# EAGLE design eth-generic (EAGLE 4.11)
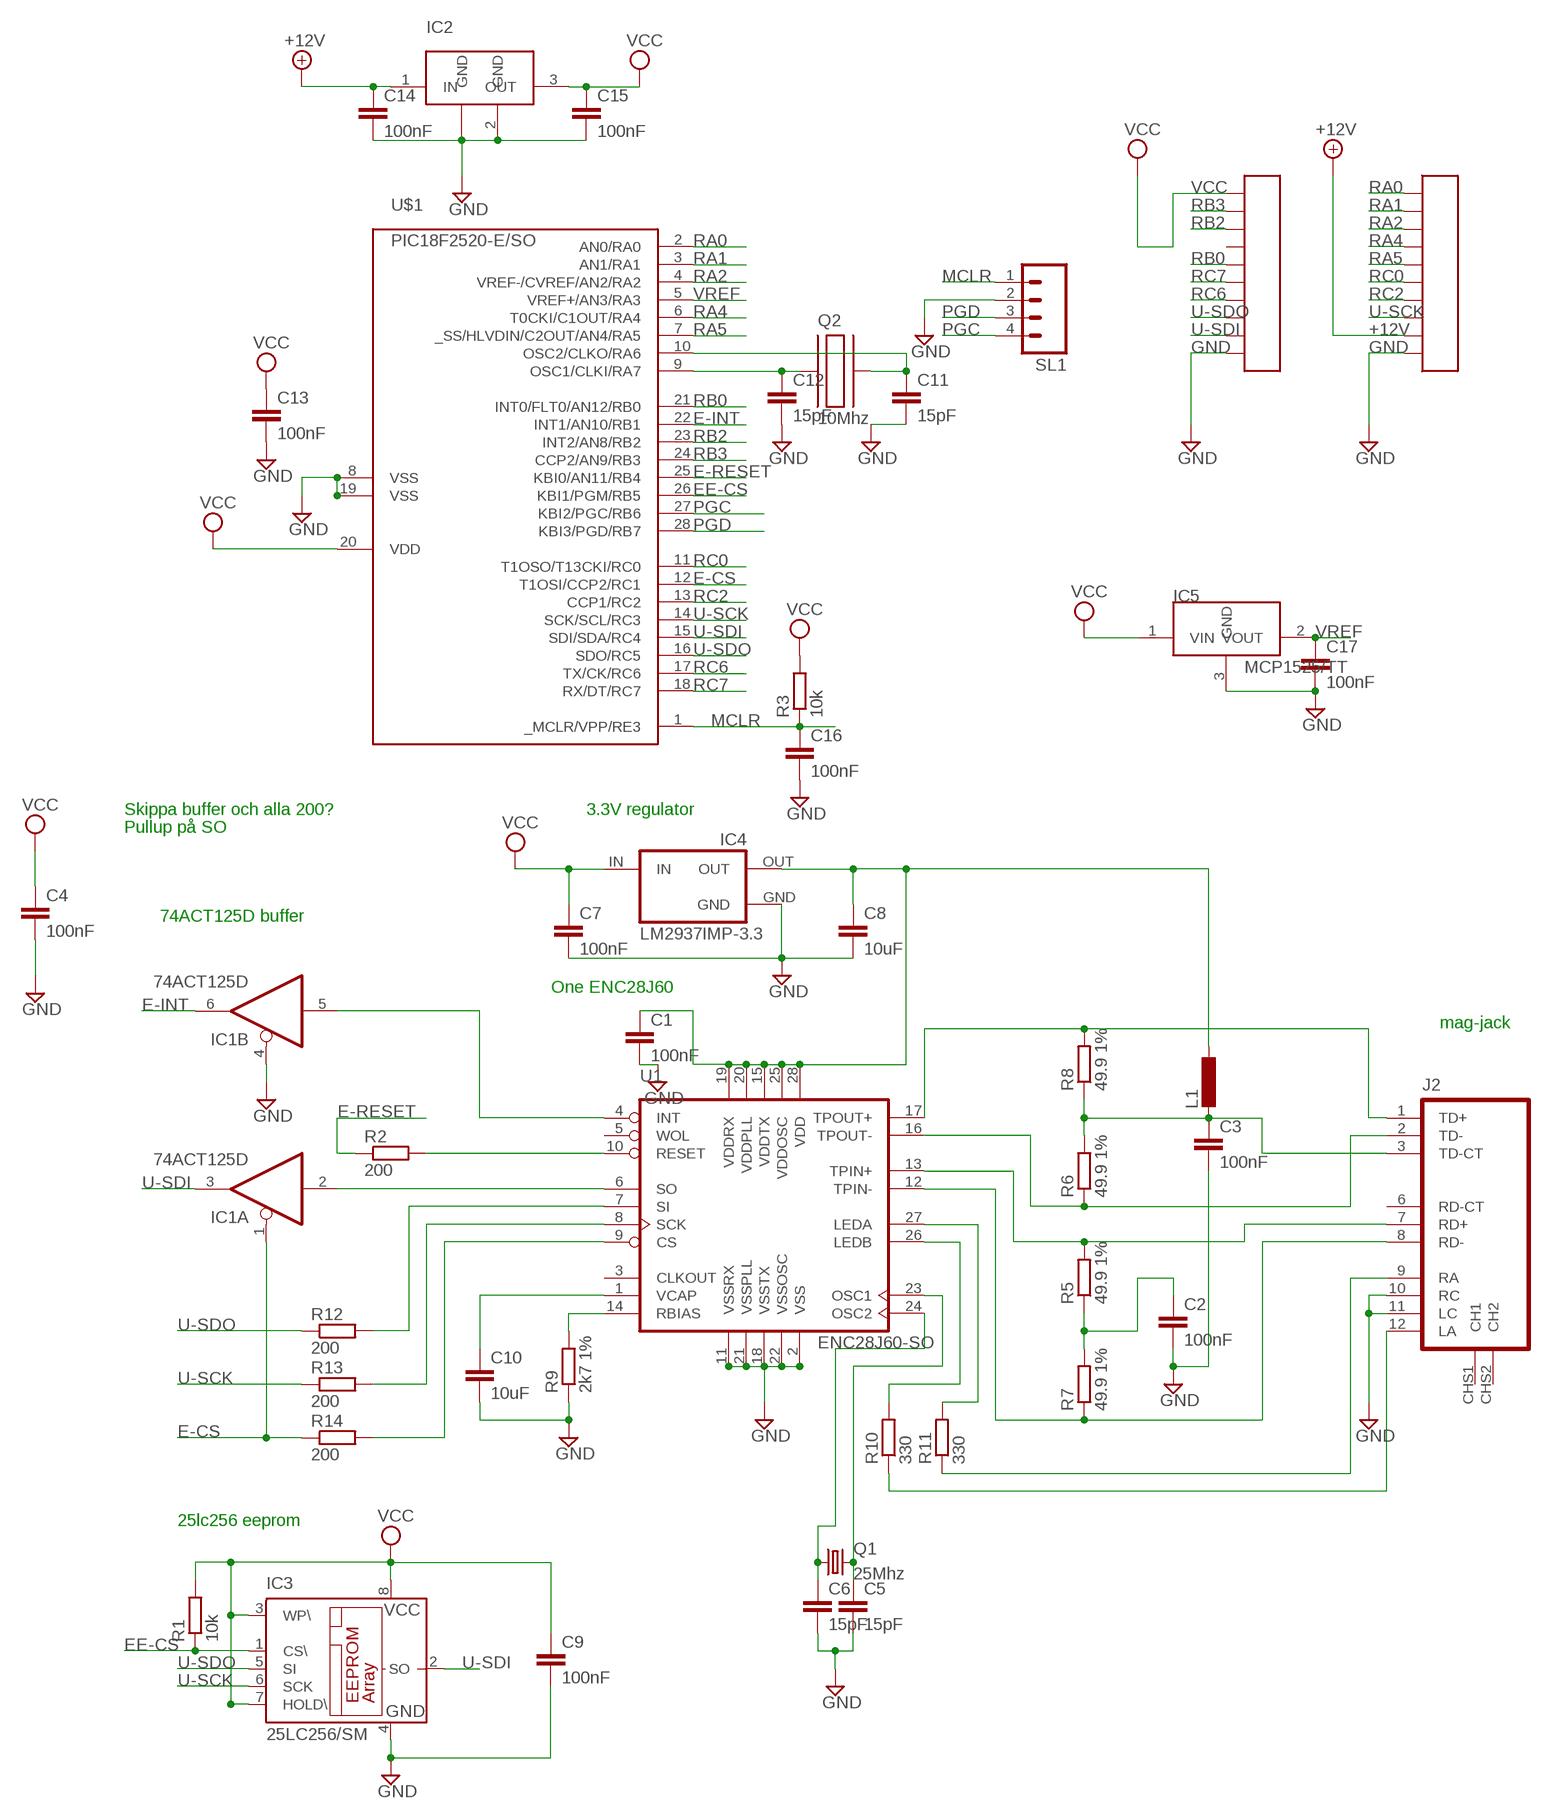
[diagram p0: schematic, sheet 1]

## Parts
C1  100nF  C-EUC0603  [C0603]
C2  100nF  C-EUC0603  [C0603]
C3  100nF  C-EUC0603  [C0603]
C4  100nF  C-EUC0603  [C0603]
C5  15pF  C-EUC0603  [C0603]
C6  15pF  C-EUC0603  [C0603]
C7  100nF  C-EUC0603  [C0603]
C8  10uF  C-EUC0603  [C0603]
C9  100nF  C-EUC0603  [C0603]
C10  10uF  C-EUC0603  [C0603]
C11  15pF  C-EUC0603  [C0603]
C12  15pF  C-EUC0603  [C0603]
C13  100nF  C-EUC0603  [C0603]
C14  100nF  C-EUC0603  [C0603]
C15  100nF  C-EUC0603  [C0603]
C16  100nF  C-EUC0603  [C0603]
C17  100nF  C-EUC0603  [C0603]
IC1  74ACT125D  [SO14]
IC2  LM340MP-5.0  [SOT223]
IC3  25LC256/SM  [SO-08M]
IC4  LM2937IMP-3.3  [SOT223]
IC5  MCP1525/TT  [SOT23]
J2  J1006F01P  [PULSEJACK-J1A]
L1  L-EUL0603  [R0603]
Q1  25Mhz  CRYTALHC49S  [HC49/S]
Q2  10Mhz  C-MAC-LFA147E  [SMD]
R1  10k  R-EU_R0603  [R0603]
R2  200  R-EU_R0603  [R0603]
R3  10k  R-EU_R0603  [R0603]
R5  49.9 1%  R-EU_R0603  [R0603]
R6  49.9 1%  R-EU_R0603  [R0603]
R7  49.9 1%  R-EU_R0603  [R0603]
R8  49.9 1%  R-EU_R0603  [R0603]
R9  2k7 1%  R-EU_R0603  [R0603]
R10  330  R-EU_R0603  [R0603]
R11  330  R-EU_R0603  [R0603]
R12  200  R-EU_R0603  [R0603]
R13  200  R-EU_R0603  [R0603]
R14  200  R-EU_R0603  [R0603]
SL1  M04  [04P]
U1  ENC28J60-SO  [SO28W]
U$1  PIC18F2520-E/SO  [SO-28W]
U$3  COLUMN10  [COLUMN10]
U$4  COLUMN10  [COLUMN10]

## Nets
3.3V: C1.1 C8.1 IC4.OUT L1.1 U1.15(VDDTX) U1.19(VDDRX) U1.20(VDDPLL) U1.25(VDDOSC) U1.28(VDD)
+12V: C14.1 IC2.1(IN) U$3.9
E-CS: IC1.1(A:OE) R14.1 U$1.12(T1OSI/CCP2/RC1)
E-INT: IC1.6(B:O) U$1.22(INT1/AN10/RB1)
E-PRE-CS: R14.2 U1.9(CS)
E-PRE-INT: IC1.5(B:I) U1.4(INT)
E-PRE-SCK: R13.2 U1.8(SCK)
E-PRE-SI: R12.2 U1.7(SI)
E-PRE-SO: IC1.2(A:I) U1.6(SO)
E-RESET: R2.1 U$1.25(KBI0/AN11/RB4)
E-TPIN+: J2.7(RD+) R5.2 U1.13(TPIN+)
E-TPIN-: J2.8(RD-) R7.1 U1.12(TPIN-)
E-TPOUT+: J2.1(TD+) R8.2 U1.17(TPOUT+)
E-TPOUT-: J2.2(TD-) R6.1 U1.16(TPOUT-)
EE-CS: IC3.1(CS\) R1.1 U$1.26(KBI1/PGM/RB5)
GND: C1.2 C2.2 C3.2 C4.2 C5.2 C6.2 C7.2 C8.2 C9.2 C10.2 C11.2 C12.2 C13.2 C14.2 C15.2 C16.2 C17.2 IC1.4(B:OE) IC2.2(GND) IC2.4(GND) IC3.4(GND) IC4.GND IC5.3(GND) J2.10(RC) J2.11(LC) R9.1 SL1.2 U1.2(VSS) U1.11(VSSRX) U1.18(VSSTX) U1.21(VSSPLL) U1.22(VSSOSC) U$1.8(VSS) U$1.19(VSS) U$3.10 U$4.10
LEDA: J2.9(RA) R11.1
LEDB: J2.12(LA) R10.1
MCLR: C16.1 R3.1 SL1.1 U$1.1(_MCLR/VPP/RE3)
N$1: R2.2 U1.10(RESET)
N$2: C11.1 Q2.P$2 U$1.10(OSC2/CLKO/RA6)
N$3: C12.1 Q2.P$1 U$1.9(OSC1/CLKI/RA7)
N$14: C2.1 R5.1 R7.2
OSC1: C6.1 Q1.1 U1.24(OSC2)
OSC2: C5.1 Q1.2 U1.23(OSC1)
PGC: SL1.4 U$1.27(KBI2/PGC/RB6)
PGD: SL1.3 U$1.28(KBI3/PGD/RB7)
PRE-LEDA: R11.2 U1.27(LEDA)
PRE-LEDB: R10.2 U1.26(LEDB)
PRE-VCAP: C10.1 U1.1(VCAP)
RA0: U$1.2(AN0/RA0) U$3.1
RA1: U$1.3(AN1/RA1) U$3.2
RA2: U$1.4(VREF-/CVREF/AN2/RA2) U$3.3
RA4: U$1.6(T0CKI/C1OUT/RA4) U$3.4
RA5: U$1.7(_SS/HLVDIN/C2OUT/AN4/RA5) U$3.5
RB0: U$1.21(INT0/FLT0/AN12/RB0) U$4.5
RB2: U$1.23(INT2/AN8/RB2) U$4.3
RB3: U$1.24(CCP2/AN9/RB3) U$4.2
RBIAS: R9.2 U1.14(RBIAS)
RC0: U$1.11(T1OSO/T13CKI/RC0) U$3.6
RC2: U$1.13(CCP1/RC2) U$3.7
RC6: U$1.17(TX/CK/RC6) U$4.7
RC7: U$1.18(RX/DT/RC7) U$4.6
TD-CT: C3.1 J2.3(TD-CT) L1.2 R6.2 R8.1
U-SCK: IC3.6(SCK) R13.1 U$1.14(SCK/SCL/RC3) U$3.8
U-SDI: IC1.3(A:O) IC3.2(SO) U$1.15(SDI/SDA/RC4) U$4.9
U-SDO: IC3.5(SI) R12.1 U$1.16(SDO/RC5) U$4.8
VCC: C4.1 C7.1 C9.1 C13.1 C15.1 IC2.3(OUT) IC3.3(WP\) IC3.7(HOLD\) IC3.8(VCC) IC4.IN IC5.1(VIN) R1.2 R3.2 U$1.20(VDD) U$4.1
VREF: C17.1 IC5.2(VOUT) U$1.5(VREF+/AN3/RA3)
Unconnected: IC1.8(C:O) IC1.9(C:I) IC1.10(C:OE) IC1.11(D:O) IC1.12(D:I) IC1.13(D:OE) J2.6(RD-CT) J2.CHS1(CH1) J2.CHS2(CH2) U1.3(CLKOUT) U1.5(WOL) U$4.4

## Notes on the sheet
- Skippa buffer och alla 200? | 3.3V regulator
- Pullup på SO
- 74ACT125D buffer
- One ENC28J60
- mag-jack
- 25lc256 eeprom

## Power pins joined to a net without a drawn wire
GND: IC1.7(P:GND) IC4.GND@(GND)
VCC: IC1.14(P:VCC)

## Library data of the parts
C1-C17 = rcl:C-EU: CAPACITOR, European symbol
IC1 = 74xx-eu:74*125: Quad bus BUFFER, 3-state
IC2 = lm340mp:LM340MP-5.0
IC3 = microchip:25LC256
IC4 = lm2937:LM2937IMP-*: 400 and 500 mA Low Dropout Voltage Regulator NATIONAL SEMICONDUCTOR created by Peter.Hofmann@ph-tronic.de <mailto:Reter.Hofmann@ph-tronic.de> 10-2004 Rev.0
IC5 = vref:MCP1525
J2 = pulsejack:J1006F01P
L1 = rcl:L-EU: INDUCTOR, European symbol
Q1 = crystal:CRYTAL: CRYSTAL
Q2 = hc49-4h-smx:C-MAC-LFA147E
R1-R3 R5-R14 = rcl:R-EU_: RESISTOR, European symbol
SL1 = con-amp-quick:M04: AMP QUICK CONNECTOR
U1 = microchip-enc28j60:ENC28J60-*: Microchip 10Mbit Eth. contoller with SPI interface
U$1 = pic18fxx20:PIC18*2520: PIC18*2520 Microchip FLASH Microcontroller with A/D DEVICE FEATURES Feature PIC18*2520 Program Memory (bytes) 32768 Program Memory (instructions) 16384 Interupt Sources 19 I/O Ports Ports A, B, C, (E) Capture/Compare/PWM Modules 2 Enhanced Capture/Compare/PWM Modules 0 Parallel Communications (PSP) No 10-bit Analog-to-Digital Module 10 input Channels Package Types 28-pin PDIP 28-pin SOIC 28-pin QFN NOTES: F only after 18, means standard voltage range from 4.2v to 5.5v LF after 18, means extended voltage range from 2.0v to 5.5v -E before / denotes extended temperature range from -40°C to +120°C -I before / denotes industrial temperature range from -40°C to +85°C /PT suffix denotes TQFP package /SO suffix denotes SOIC package /SP suffix denotes Skinny Plastic DIP package /P suffix denotes Plastic DIP package /ML suffix denotes QFN package
U$3 U$4 = expboard:COLUMN10

## Board
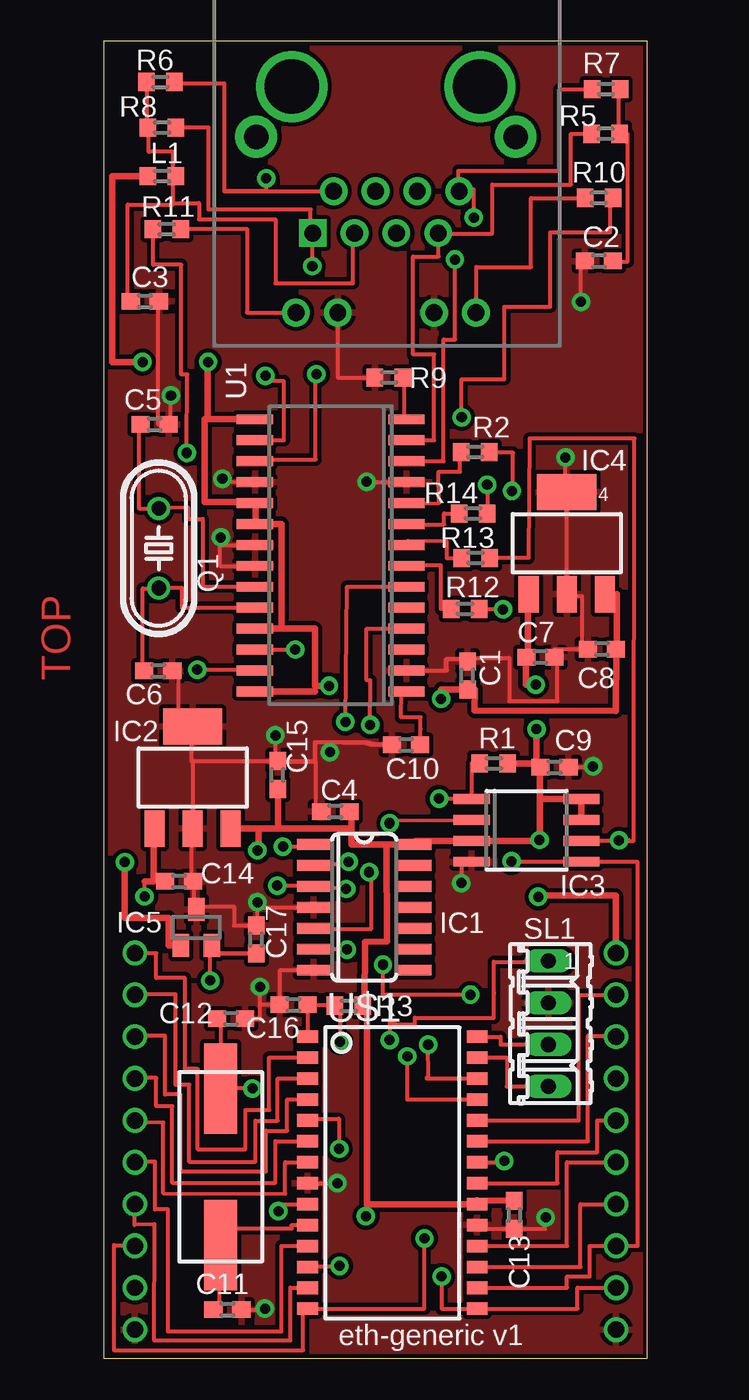
[diagram p1: board, top side]
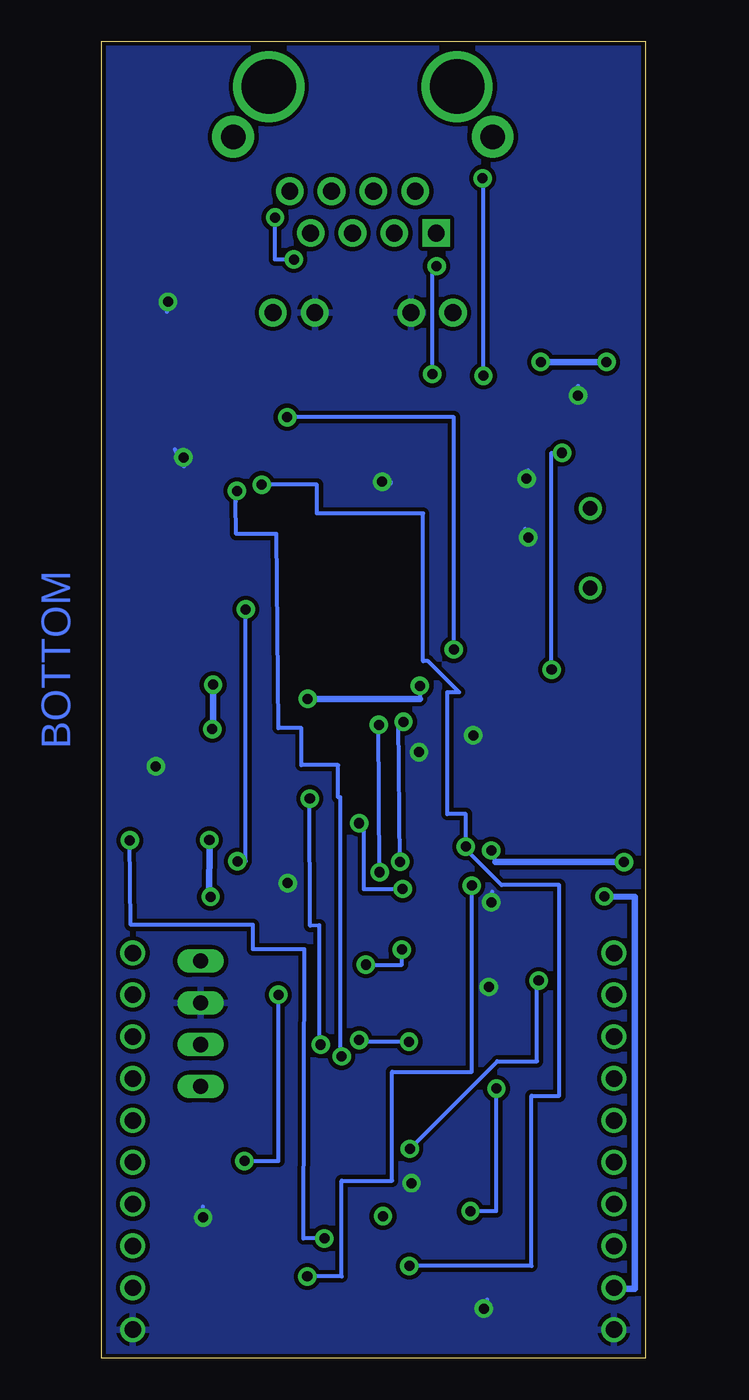
[diagram p2: board, bottom side, seen from below]

Size 33 x 79.93 mm. Coordinates in mm from the lower left corner, seen from the top.
Outline: 0,0 33,0 33,79.93 0,79.93 0,0
Copper layers (1*16): Top 0.035mm / dielectric 1.5mm / Bottom 0.035mm
Design rules "10mils": minimum track width 10mil, minimum drill 0.6mm, track to track 10mil, track to pad 10mil, pad to pad 10mil, via to via 10mil, smd to smd 10mil, copper to edge 10mil, drill to drill 10mil, minimum pad ring 10mil, minimum via ring 10mil, stop-mask expansion 0mil, vias tented up to drill 0mil, thermal gap 10mil

### Footprints (pad centres in the part's own frame; a part is rotated, then mirrored left to right if it is on the bottom)
C0603 = smd 1.1 x 1: 1 -0.85,0; 2 0.85,0
SO14 = smd 0.66 x 2.032: 1 -3.81,-3.073; 2 -2.54,-3.073; 3 -1.27,-3.073; 4 0,-3.073; 5 1.27,-3.073; 6 2.54,-3.073; 7 3.81,-3.073; 8 3.81,3.073; 9 2.54,3.073; 10 1.27,3.073; 11 0,3.073; 12 -1.27,3.073; 13 -2.54,3.073; 14 -3.81,3.073
SOT223 = smd 1.219 x 2.235: 1 -2.311,-3.099; 2 0,-3.099; 3 2.311,-3.099 | smd 3.6 x 2.2: 4 0,3.099
SO-08M = smd 0.6 x 2.2: 1 -1.905,-3.33; 2 -0.635,-3.33; 3 0.635,-3.33; 4 1.905,-3.33; 5 1.905,3.33; 6 0.635,3.33; 7 -0.635,3.33; 8 -1.905,3.33
SOT223' = smd 1.219 x 2.235: GND 0,-3.099; IN -2.311,-3.099; OUT 2.311,-3.099 | smd 3.6 x 2.2: GND@ 0,3.099
SOT23 = smd 1 x 1.4: 1 -0.95,-1.1; 2 0.95,-1.1; 3 0,1.1
PULSEJACK-J1A = drill 1.016 pad 1.676 square: 1 -4.445,-4.572 | drill 1.016 pad 1.676 round: 2 -3.175,-2.032; 3 -1.905,-4.572; 4 -0.635,-2.032; 5 0.635,-4.572; 6 1.905,-2.032; 7 3.175,-4.572; 8 4.445,-2.032; 9 -5.461,-9.398; 10 -2.921,-9.398; 11 2.921,-9.398; 12 5.461,-9.398 | drill 1.5 pad 2.54 round: CHS1 7.874,1.27; CHS2 -7.874,1.27 | drill 3.3 round: P$1 -5.715,4.318; P$2 5.715,4.318
R0603 = smd 1 x 1.1: 1 -0.85,0; 2 0.85,0
HC49/S = drill 0.889 round: 1 -2.413,0; 2 2.413,0
SMD = smd 5.5 x 2: P$1 4.75,0; P$2 -4.75,0
04P = drill 0.914 long: 1 -3.81,0; 2 -1.27,0; 3 1.27,0; 4 3.81,0
SO28W = smd 0.6 x 2.2: 1 -8.255,-4.6; 2 -6.985,-4.6; 3 -5.715,-4.6; 4 -4.445,-4.6; 5 -3.175,-4.6; 6 -1.905,-4.6; 7 -0.635,-4.6; 8 0.635,-4.6; 9 1.905,-4.6; 10 3.175,-4.6; 11 4.445,-4.6; 12 5.715,-4.6; 13 6.985,-4.6; 14 8.255,-4.6; 15 8.255,4.6; 16 6.985,4.6; 17 5.715,4.6; 18 4.445,4.6; 19 3.175,4.6; 20 1.905,4.6; 21 0.635,4.6; 22 -0.635,4.6; 23 -1.905,4.6; 24 -3.175,4.6; 25 -4.445,4.6; 26 -5.715,4.6; 27 -6.985,4.6; 28 -8.255,4.6
SO-28W = smd 0.762 x 1.27: 1 -7.62,-5.207; 2 -6.35,-5.207; 3 -5.08,-5.207; 4 -3.81,-5.207; 5 -2.54,-5.207; 6 -1.27,-5.207; 7 0,-5.207; 8 1.27,-5.207; 9 2.54,-5.207; 10 3.81,-5.207; 11 5.08,-5.207; 12 6.35,-5.207; 13 7.62,-5.207; 14 8.89,-5.207; 15 8.89,5.08; 16 7.62,5.08; 17 6.35,5.08; 18 5.08,5.08; 19 3.81,5.08; 20 2.54,5.08; 21 1.27,5.08; 22 0,5.08; 23 -1.27,5.08; 24 -2.54,5.08; 25 -3.81,5.08; 26 -5.08,5.08; 27 -6.35,5.08; 28 -7.62,5.08
COLUMN10 = drill 1 round: 1 0,11.43; 2 0,8.89; 3 0,6.35; 4 0,3.81; 5 0,1.27; 6 0,-1.27; 7 0,-3.81; 8 0,-6.35; 9 0,-8.89; 10 0,-11.43

### Placement (x,y rotation side)
C1  22.09,41.44 90 top
C2  30.07,66.59 180 top
C3  2.51,64.15 0 top
C4  14.07,33.19 180 top
C5  3.09,56.68 0 top
C6  3.32,41.72 0 top
C7  26.51,42.56 0 top
C8  30.25,43.04 180 top
C9  27.38,35.88 0 top
C10  18.36,37.22 180 top
C11  7.51,2.96 0 top
C12  7.74,20.61 0 top
C13  24.91,8.7 270 top
C14  4.59,28.94 0 top
C15  10.56,35.4 90 top
C16  11.53,21.45 180 top
C17  9.27,25.41 90 top
IC1  15.82,27.37 270 top
IC2  5.41,35.24 0 top
IC3  25.67,32.04 270 top
IC4  LM2937IMP-3.3  [SOT223']  28.11,49.47 0 top
IC5  5.63,26.15 0 top
J2  17.14,72.86 0 top
L1  3.55,71.74 0 top
Q1  3.35,49.16 90 top
Q2  7.11,11.62 90 top
R1  23.69,36.11 0 top
R2  22.55,55 180 top
R3  14.88,21.4 0 top
R5  30.47,74.31 180 top
R6  3.45,77.46 180 top
R7  30.5,77.03 0 top
R8  3.55,74.69 0 top
R9  17.32,59.53 0 top
R10  30.07,70.42 0 top
R11  3.83,68.52 180 top
R12  21.94,45.48 180 top
R13  22.58,48.58 180 top
R14  22.42,51.27 180 top
SL1  27,20.31 270 top
U1  13.79,48.73 90 top
U$1  17.6,11.9 270 top
U$3  1.9,13.17 0 top
U$4  31.11,13.17 0 top

### Tracks (layer width: path | path; a pad name or v marks a point on that pad's centre or on a via)
3.3V  (via drill 0.61)
  Top 0.254: 31.16,43.04 31.13,43.04 C8.1 | 31.16,46.37 IC4.OUT | C1.1 22.55,40.59 | 6.14,56.99 6.32,56.99 6.32,56.91 | 9.14,51.96 9.14,51.91 U1.19 9.24,51.91 | 9.24,50.56 9.24,50.64 U1.20 | U1.25 9.16,44.29 9.16,44.26 | 6.32,60.47 v6.35,60.47 | 12.82,40.48 12.82,40.83 12.82,40.81 | U1.28 9.27,40.48 9.27,40.5
  Top 0.406: 31.16,43.04 31.16,46.37 | 22.55,40.59 22.52,39.31 31.11,39.3 31.13,43.04 | U1.15 6.32,56.99 6.32,60.47 | 6.14,56.99 6.14,51.96 9.14,51.96 | 9.24,50.64 9.24,51.91 | U1.20 10.79,50.64 10.79,44.29 | 10.79,44.29 9.16,44.29 | L1.1 0.53,71.74 0.53,60.47 v2.36,60.47 | 10.79,44.29 12.82,44.29 12.82,40.83 | 9.27,40.48 12.82,40.48 | C1.1 20.49,40.59 v20.49,40.02 | 12.82,40.81 v13.69,40.81
  Bottom 0.254: v13.69,40.81 13.69,40.02
  Bottom 0.406: v6.35,60.47 v2.36,60.47 | 13.69,40.02 v20.49,40.02
+12V  (via drill 0.61)
  Top 0.254: 3.04,32.14 IC2.1 | 3.04,28.94 C14.1 | v2.48,28.03 2.48,28.94
  Top 0.406: 3.04,32.14 3.04,28.94 2.48,28.94
  Bottom 0.254: U$3.9 1.95,4.28 1.95,4.23
  Bottom 0.406: v2.48,28.03 0.63,28 0.63,4.23 1.95,4.23
E-CS  (via drill 0.61)
  Top 0.254: R14.1 v23.29,53.02 | IC1.1 12.7,31.18 12.7,31.05 v10.89,31.05 | U$1.12 14.32,5.55 v14.32,5.6
  Bottom 0.254: v23.29,53.02 19.93,53.02 19.93,51.27 13.48,51.27 13.48,42.3 13.18,42.3 11.3,40.42 12.01,40.42 12.01,33.03 10.89,33.03 v10.89,31.05 10.87,31.05 | v14.32,5.6 6.9,5.6 6.9,15.94 5.23,15.94 5.23,28.71 8.73,28.71 11.04,31.03 10.89,31.03 10.87,31.05 | 10.87,31.05 10.84,31.08
E-INT  (via drill 0.61)
  Top 0.254: U$1.22 24.02,11.9 v24.33,11.98 | v22.27,22.06 16.96,22.06 v16.96,23.89 | 12.87,24.83 12.87,24.85 | 12.87,24.83 IC1.6 | v14.78,24.8 12.87,24.8 12.87,24.83
  Bottom 0.254: v24.33,11.98 22.27,11.98 v22.27,22.06 | v16.96,23.89 14.78,23.89 v14.78,24.8
E-PRE-CS
  Top 0.254: R14.2 20.67,51.27 20.67,50.61 18.38,50.61 | 18.38,50.61 U1.9 | 18.38,50.61 18.38,50.58
E-PRE-INT  (via drill 0.61)
  Top 0.254: U1.4 15.97,44.29 15.97,41.16 16.2,41.14 v16.17,38.44 | v16.12,29.5 16.25,29.91 16.25,26.07 12.8,26.07 12.8,26.1 IC1.5
  Bottom 0.254: v16.17,38.44 16.2,38.44 v16.12,29.5
E-PRE-SCK
  Top 0.254: R13.2 20.82,48.58 20.82,49.59 18.49,49.62 18.49,49.37 U1.8
E-PRE-SI
  Top 0.254: R12.2 20.47,45.48 20.47,48.12 18.46,48.12 18.46,48.1 U1.7
E-PRE-SO  (via drill 0.61)
  Top 0.254: U1.6 14.78,46.83 v14.68,38.62 | 14.88,30.37 v14.88,30.14 14.88,30.01 12.82,30.01 | 12.82,30.01 12.82,29.91 IC1.2 | 12.82,30.01 12.82,30.04
  Bottom 0.254: v14.68,38.62 14.98,38.62 v14.88,30.14
E-RESET  (via drill 0.61)
  Top 0.254: U$1.25 18.43,15.71 v18.43,18.33 | v24.79,52.64 24.86,52.64 24.86,54.95 23.24,54.95 23.34,54.93 R2.1
  Bottom 0.254: v18.43,18.33 18.51,18.33 18.51,34.05 18.64,34.05 18.64,36.01 20.87,36.01 20.87,38.24 22.27,38.24 22.4,50.03 24.84,50.03 24.86,52.01 24.76,52.67 v24.79,52.64
E-TPIN+
  Top 0.254: R5.2 28.37,74.31 28.37,71.23 23.59,71.23 23.59,68.26 20.37,68.26 20.37,68.29 | 20.37,68.29 20.37,68.31 | 20.37,68.29 J2.7 20.34,68.29 20.34,66.87 18.79,66.87 18.79,60.92 20.06,60.92 20.06,55.72 U1.13
E-TPIN-  (via drill 0.61)
  Top 0.254: R7.1 27.68,77.03 27.68,72.07 21.53,72.07 21.53,70.85 | 21.53,70.83 21.53,70.8 | U1.12 20.64,54.45 20.64,61.84 21.33,61.84 v21.33,66.69 | v22.47,69.23 22.47,70.93 21.53,70.93 21.53,70.85 | 21.53,70.85 21.53,70.83 | 21.53,70.83 J2.8
  Bottom 0.254: v21.33,66.69 22.47,66.69 v22.47,69.23
E-TPOUT+  (via drill 0.61)
  Top 0.254: R8.2 6.37,74.69 6.37,69.71 12.57,69.71 12.57,68.29 | 12.57,68.29 12.57,68.24 12.67,68.24 v12.67,66.28 | 12.57,68.29 J2.1 | v12.92,59.73 12.87,59.73 12.87,54.55 9.19,54.55 U1.17
  Bottom 0.254: v12.67,66.28 12.92,66.28 v12.92,59.73
E-TPOUT-  (via drill 0.61)
  Top 0.254: 7.34,70.83 J2.2 | 7.34,70.83 7.34,77.36 4.31,77.36 4.31,77.46 | 4.31,77.46 4.31,77.53 | 4.31,77.46 R6.1 | 7.34,70.83 9.88,70.83 v9.88,71.62 | v9.83,59.63 9.9,59.63 9.9,59.3 10.94,59.3 10.94,55.72 U1.16
  Bottom 0.254: v9.88,71.62 10.05,71.62 10.05,71.64 9.83,71.64 v9.83,59.63
EE-CS  (via drill 0.61)
  Top 0.254: R1.1 22.35,36.11 IC3.1 | U$1.26 19.63,16.98 19.63,17.03 19.73,17.03 v19.7,19.04 | IC3.1 22.35,33.85 | IC3.1 | v20.37,33.97 22.35,33.97 IC3.1
  Bottom 0.254: v19.7,19.04 19.78,19.16 19.78,26.28 20.34,26.25 v20.37,33.97
GND  (via drill 0.61)
  Top 0.254: U$1.19 22.75,8.09 23.08,7.85 C13.2 26.79,7.85 v26.84,8.55 | C6.2 4.57,41.72 4.57,38.34 IC2.4 5.33,38.34 | 5.33,38.34 5.33,38.47 | 5.43,36.25 5.33,36.25 5.33,38.34 | 5.43,36.25 C15.2 10.56,36.21 12.87,36.21 | 5.43,36.25 5.43,36.31 | 5.43,36.25 5.43,32.14 IC2.2 5.35,32.14 5.35,28.97 | C14.2 5.35,28.94 5.35,28.97 | 5.66,27.42 5.66,27.25 IC5.3 | 5.66,27.42 7.92,27.42 7.92,26.26 C17.2 9.34,26.26 9.34,27.45 | 5.35,28.97 5.48,28.97 5.48,27.42 5.66,27.42 | 9.34,27.45 v9.34,27.67 | 9.34,27.45 9.29,27.45 9.29,27.37 IC1.4 | U1.18 7.23,53.2 v7.21,53.38 | 3.32,64.15 3.32,64.17 | 3.32,64.15 C3.2 | 3.32,64.15 3.32,56.68 C5.2 4.08,56.68 v4.08,58.43 | 29.05,43.04 C8.2 | 29.05,43.04 29.05,46.24 28.11,46.24 IC4.GND | IC4.GND | IC4.GND IC4.GND@ 28.04,52.57 v28.04,54.67 | C1.2 22.07,42.29 22.07,42.43 20.8,42.43 20.8,41.75 U1.2 20.85,41.75 20.85,42.46 22.12,42.46 22.12,42.51 24.63,42.51 24.63,39.89 27.55,39.89 27.55,42.63 27.38,42.63 | 27.38,42.56 27.38,42.53 | 27.38,42.56 C7.2 | 29.05,43.04 27.38,43.04 27.38,42.63 | 27.38,42.63 27.38,42.56 | U1.11 15.97,53.18 v15.97,53.2 | C2.2 28.98,66.59 v28.98,64.12 | R9.1 14.22,59.53 J2.10 | 7.08,49.37 7.08,48.1 U1.22 | U1.22 | U1.22 9.19,48.07 | 7.08,49.37 U1.21 | 7.08,49.37 v7.11,49.82 | C11.2 9.57,2.96 v9.8,3.01 | C4.2 12.87,33.19 12.87,36.21 | C12.2 9.5,20.61 9.5,21.48 | 9.5,21.48 10.54,21.48 10.54,21.45 C16.2 10.71,21.45 | 10.71,21.45 10.71,21.43 | 10.71,21.48 10.71,21.45 | IC1.7 10.71,23.56 10.71,21.48 | 9.5,21.48 10.71,21.48 | 9.5,21.48 v9.5,22.54 | 12.87,36.21 12.85,36.21 12.82,37.4 16.17,37.35 16.23,37.3 C10.2 | C9.2 29.46,35.88 v29.71,35.93 | U$1.8 v14.19,10.63 | IC3.4 21.71,30.14 v21.71,28.84
  Top 0.254: C10.2 15.97,37.3 15.97,37.38 13.71,37.35 v13.74,36.79 | C10.2 16.17,37.22 16.02,37.38 12.85,37.38 12.85,36.26 12.82,36.23 C15.2 10.43,36.36 v10.43,37.81
  Bottom 0.254: v26.84,8.55 26.84,9.21 | v9.34,27.67 9.29,27.67 9.29,28.31 | v7.21,53.38 7.11,53.38 7.11,53.89 | v28.04,54.67 28.01,54.14 28.54,55.16 | v15.97,53.2 15.46,53.2 15.46,53.1 | v28.98,64.12 29.05,64.12 29.05,63.51 | v7.11,49.82 7.29,50.33 | v4.08,58.43 4.08,59.02 | v9.8,3.01 9.6,3.04 9.6,3.57 | v9.5,22.54 9.47,22.36 9.47,22.59 | v29.71,35.93 29.56,35.93 29.56,35.95 | v14.19,10.63 14.35,10.63 14.35,10.65 | v21.71,28.84 21.74,29.1 21.74,28.99 | v13.74,36.79 13.81,36.79 13.81,36.44 | v10.43,37.81 10.16,38.09
  pour Bottom (isolate 0.254): 0.22,79.69 0.22,0.27 32.68,0.27 32.66,79.69
  pour Top: 0.12,79.59 0.25,79.59 0.25,0.24 32.76,0.24 32.76,0.6 32.76,79.72 0.12,79.72
LEDA
  Top 0.254: J2.9 8.71,63.46 8.71,68.54 4.87,68.54 4.87,68.52 R11.1
LEDB
  Top 0.254: R10.1 25.95,70.42 25.95,66.23 22.63,66.23 22.63,63.46 J2.12
MCLR  (via drill 0.61)
  Top 0.254: R3.1 14.09,21.4 14.09,21.45 | 14.09,21.45 C16.1 12.42,21.45 12.42,19.52 U$1.1 | 14.09,21.45 14.35,21.45 v14.35,19.21 | 23.69,22.24 23.69,22.11 | 23.69,22.24 23.69,24.07 26.94,24.07 26.94,24.12 | 26.94,24.12 26.94,24.14 | 26.94,24.12 SL1.1 | v17.37,19.32 17.39,20.38 17.75,20.28 18.56,20.26 18.89,20.26 18.89,20.66 23.69,20.66 23.69,22.24
  Bottom 0.254: v14.35,19.21 17.32,19.21 v17.37,19.32
N$1
  Top 0.254: R2.2 21.64,55.03 21.64,53.81 20.34,53.81 20.37,51.91 18.41,51.88 18.41,51.91 | 18.41,51.91 18.41,51.93 | U1.10 18.41,51.91
N$2
  Top 0.254: Q2.P$2 7.08,6.87 7.08,6.79 | C11.1 7.03,3.14 7.08,6.79 | 7.08,6.79 7.03,6.79 7.06,7.89 11.43,7.89 11.43,8.09 U$1.10
N$3  (via drill 0.61)
  Top 0.254: 7.13,16.37 7.13,16.32 | C12.1 7.13,20.61 7.13,16.37 | U$1.9 10.61,9.36 v10.61,8.93 | 7.13,16.37 | 7.13,16.37 Q2.P$1 | v9.04,16.37 7.13,16.37 | 7.13,16.37 7.13,16.22
  Bottom 0.254: v10.61,8.93 9.04,8.93 v9.04,16.37
N$14
  Top 0.254: R7.2 31.29,77.03 31.29,74.31 | 31.29,74.31 R5.1 | 31.29,74.31 31.82,74.31 31.82,66.56 30.93,66.56 30.93,66.59 C2.1
OSC1
  Top 0.254: C6.1 2.38,41.72 2.38,46.72 3.27,46.72 3.27,46.75 Q1.1 3.4,46.75 3.4,46.77 4.75,46.77 4.75,45.56 U1.24
OSC2
  Top 0.254: U1.23 6.02,46.83 6.02,50.94 5.13,50.94 5.13,51.65 3.35,51.63 Q1.2 2.15,51.58 2.15,56.68 | 2.15,56.68 2.15,56.71 | 2.15,56.68 C5.1
PGC
  Top 0.254: SL1.4 24.48,16.5 24.48,18.25 U$1.27 22.68,18.27
PGD
  Top 0.254: SL1.3 24.1,19.04 24.1,19.52 U$1.28
PRE-LEDA  (via drill 0.61)
  Top 0.254: R11.2 3.02,68.52 3.02,66.36 4.72,66.36 4.72,59.7 5.08,59.7 v5.05,54.95 | U1.27 9.19,41.69 | U1.27 | v5.69,41.8 9.19,41.8 U1.27
  Bottom 0.254: v5.05,54.95 5.69,54.95 v5.69,41.8
PRE-LEDB  (via drill 0.61)
  Top 0.254: R10.2 30.75,70.42 30.75,68.34 27.12,68.34 27.12,63.82 24.33,63.82 24.33,59.42 21.74,59.42 v21.74,57.11 | U1.26 9.24,43.02 | 9.24,43.02 v11.63,43.02 | 9.24,43.02 9.24,42.99
  Bottom 0.254: v21.74,57.11 11.63,57.11 v11.63,43.02
PRE-VCAP
  Top 0.254: C10.1 19.25,38.21 19.25,38.9 18.05,38.9 18.08,40.48 U1.1
RA0
  Top 0.254: U$1.2 10.05,18.25 10.05,15.07 8.61,15.07 8.61,12.69 5.71,12.69 5.71,17.56 4.95,17.56 4.95,23.08 3.19,23.08 3.19,24.57 1.88,24.57 1.88,24.6 U$3.1
RA1
  Top 0.254: U$1.3 10.56,16.98 10.56,14.41 9.21,14.41 9.21,11.92 5.2,11.92 5.2,16.6 4.36,16.6 4.36,22.09 2,22.09 2,22.06 U$3.2
RA2
  Top 0.254: U$1.4 11.15,15.71 11.15,13.8 9.85,13.8 9.85,11.34 4.67,11.34 4.67,16.02 3.73,16.02 3.73,19.57 1.88,19.57 | 1.88,19.57 1.88,19.52 U$3.3 | 1.88,19.57 1.88,19.6
RA4
  Top 0.254: U$1.6 10.43,13.17 10.43,10.65 4.16,10.65 4.16,15.3 3.19,15.3 3.19,17 1.82,17 | 1.82,17 1.82,16.98 U$3.4 | 1.82,17 1.82,17.06
RA5
  Top 0.254: U$1.7 11.02,11.9 11.02,9.99 3.63,10.02 3.63,14.31 1.9,14.29 U$3.5
RB0
  Top 0.254: U$4.5 29.97,14.44 29.97,12.51 27.55,12.51 27.55,10.63 22.78,10.63 | U$1.21 22.78,10.63 | 22.78,10.63 22.78,10.65
RB2
  Top 0.254: U$1.23 29.41,13.17 29.41,19.57 31.03,19.57 31.03,19.52 U$4.3
RB3
  Top 0.254: U$4.2 28.85,22.06 28.85,14.44 22.75,14.44 | U$1.24 22.75,14.44 | 22.75,14.44 22.75,14.39
RBIAS
  Top 0.254: 18.26,59.53 18.26,59.58 | 18.26,59.53 R9.2 | U1.14 18.26,56.99 18.26,59.53
RC0
  Top 0.254: U$1.11 10.79,6.82 10.79,1.64 3.91,1.64 3.91,9.03 3.12,9.03 3.12,11.92 1.9,11.92 U$3.6
RC2
  Top 0.254: U$1.13 11.35,4.28 11.35,1.08 3.07,1.08 3.09,8.14 1.88,8.09 1.9,9.33 U$3.7
RC6
  Top 0.254: U$4.7 28.95,9.36 28.95,5.55 22.65,5.55 | U$1.17 22.65,5.55 | 22.65,5.55 22.65,5.6
RC7
  Top 0.254: U$1.18 28.14,6.82 28.14,11.9 U$4.6 31.11,11.92
TD-CT
  Top 0.254: 2.64,74.69 2.64,74.66 | 2.64,74.69 R8.1 2.74,74.69 2.74,73.22 4.21,73.22 4.21,71.74 | R6.2 2.64,77.46 2.64,74.69 | 4.21,71.74 L1.2 | C3.1 1.47,64.15 1.47,70.02 4.21,70.02 4.21,70.07 | 4.21,70.07 4.21,71.74 | J2.3 15.13,68.29 15.13,65.24 10.43,65.24 10.43,69.13 5.79,69.13 5.79,70.12 4.19,70.12 4.19,70.07 4.21,70.07
U-SCK  (via drill 0.61)
  Top 0.254: U$3.8 1.9,6.87 0.63,6.87 0.63,0.5 12.11,0.5 12.11,3.01 U$1.14 19.48,3.01 v19.48,7.28 | 31.9,31.41 IC3.6 | 31.9,31.41 32.18,31.41 32.23,55.82 25.85,55.82 25.8,48.58 23.16,48.58 | 23.16,48.58 R13.1 | 23.16,48.58 23.16,48.6 | 31.9,31.41 31.9,31.38 | v31.29,31.43 31.9,31.43 31.9,31.41
  Bottom 0.254: v19.48,7.28 20.75,7.28 20.7,24.83 23.82,24.83 23.82,26.3 31.24,26.3 v31.29,31.43
U-SDI  (via drill 0.61)
  Top 0.254: U$4.9 28.77,4.28 28.77,3.01 22.63,3.01 | 22.63,3.01 U$1.15 | 22.63,3.01 22.63,3.04 | 22.63,3.01 20.52,3.01 v20.52,4.97 | 12.9,28.64 12.9,28.54 | 12.9,28.64 IC1.3 | v10.54,28.69 12.9,28.69 12.9,28.64 | IC3.2 17.37,32.65 v17.37,32.47 | v14.73,28.49 12.9,28.66 12.9,28.64
  Bottom 0.254: v20.52,4.97 18.43,4.97 18.43,10.78 15.36,10.78 15.36,17.39 10.54,17.39 v10.54,28.69 | v17.37,32.47 17.09,32.02 17.09,28.46 14.91,28.46 v14.73,28.49
U-SDO  (via drill 0.61)
  Top 0.254: 29.51,6.82 U$4.8 | 29.51,6.82 29.51,4.97 28.14,4.97 28.14,4.28 U$1.16 | 29.51,6.82 32.43,6.82 32.43,30.11 29.03,30.11 29.03,30.14 IC3.5 24.76,30.14 v24.76,30.16 | R12.1 23.01,45.48 23.01,45.45 v24.25,45.45
  Bottom 0.254: v24.76,30.16 24.25,30.16 v24.25,45.45
VCC  (via drill 0.61)
  Top 0.254: 25.75,46.37 IC4.IN | 25.75,42.56 C7.1 25.62,42.56 | 26.51,35.88 26.51,35.83 | 26.51,35.88 C9.1 26.49,35.88 | 26.51,35.88 26.51,36.11 26.28,36.11 | IC3.7 | IC3.8 | 26.49,31.41 26.26,31.41 26.26,31.46 v26.46,31.46 | 10.59,34.55 C15.1 | 15.06,33.19 C4.1 | 15.06,32.12 15.03,32.12 15.03,32.14 | IC1.14 18.92,31.18 18.92,31.41 | 15.85,21.4 15.77,21.32 | 16,21.4 15.85,21.4 | 15.85,21.4 R3.2 | 16,9.36 16,9.49 16.02,9.49 16.02,8.62 v15.92,8.62 | v26.23,40.88 25.62,40.88 | 9.39,30.82 v9.34,30.82 | v26.39,28 26.31,28.08
  Top 0.406: C13.1 22.68,9.57 U$1.20 16,9.36 | 25.75,42.56 25.75,46.37 | 26.51,36.11 R1.2 | IC3.8 IC3.7 | 26.49,33.95 IC3.8 | 26.49,33.95 26.49,35.88 | 26.26,31.41 IC3.3 18.92,31.41 | 26.49,31.41 26.49,33.95 | 10.59,32.14 9.39,32.14 | 9.39,32.14 IC2.3 | 10.59,32.14 10.59,34.55 | 17.16,31.18 IC1.14 | 15.06,33.19 15.06,32.12 15.06,31.18 17.16,31.18 | 15.03,32.14 10.59,32.14 | 15.85,21.4 15.87,25.26 17.22,25.29 17.16,31.18 | 16,9.49 16,21.4 | 26.28,36.11 v26.28,38.19 | 25.62,40.88 25.62,42.56 | IC5.1 3.96,25.05 3.96,26.73 1.29,26.73 v1.29,30.11 | 9.39,32.14 9.39,30.82 | U$4.1 31.11,26.78 31.08,28.08 26.31,28.08
  Bottom 0.254: v15.92,8.62 15.92,8.39 | v26.28,38.19 26.23,38.52 | v9.34,30.82 9.09,30.11 | 26.49,27.95 v26.39,28
  Bottom 0.406: 26.23,38.52 v26.23,40.88 | 9.09,30.11 v1.29,30.11 | v26.46,31.46 26.49,27.95
VREF  (via drill 0.61)
  Top 0.254: IC5.2 6.68,25.05 6.68,24.56 C17.1 6.47,24.56 v6.47,22.92 | v14.29,12.71 14.29,14.52 14.27,14.54 12.54,14.54 12.44,14.44 U$1.5
  Bottom 0.254: v6.47,22.92 6.57,22.92 6.57,18.02 8.99,18.02 v14.29,12.71

### Text on the board
Top: TOP
Bottom: BOTTOM
tNames: eth-generic v1